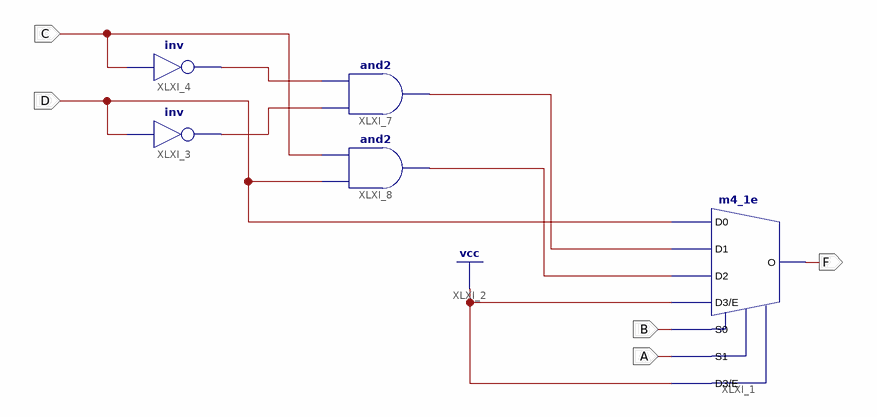
[diagram p0: schematic sheet 1]
// Xilinx ISE schematic C3_47.sch (kintex7) as structural Verilog: 5 symbols, 5 ports
module C3_47 (
  input  C,
  input  D,
  input  B,
  input  A,
  output F
);

  wire XLXN_15, XLXN_16, XLXN_17, XLXN_18;

  not XLXI_3 (XLXN_16, D);
  not XLXI_4 (XLXN_15, C);
  m4_1e XLXI_1 (.D0(D), .D1(XLXN_17), .D2(XLXN_18), .D3(1'b1), .E(1'b1), .S0(B), .S1(A), .O(F));
  and XLXI_7 (XLXN_17, XLXN_16, XLXN_15);
  and XLXI_8 (XLXN_18, D, C);
endmodule
